# Altium schematic sheet PowerSupply.SchDoc
size A3
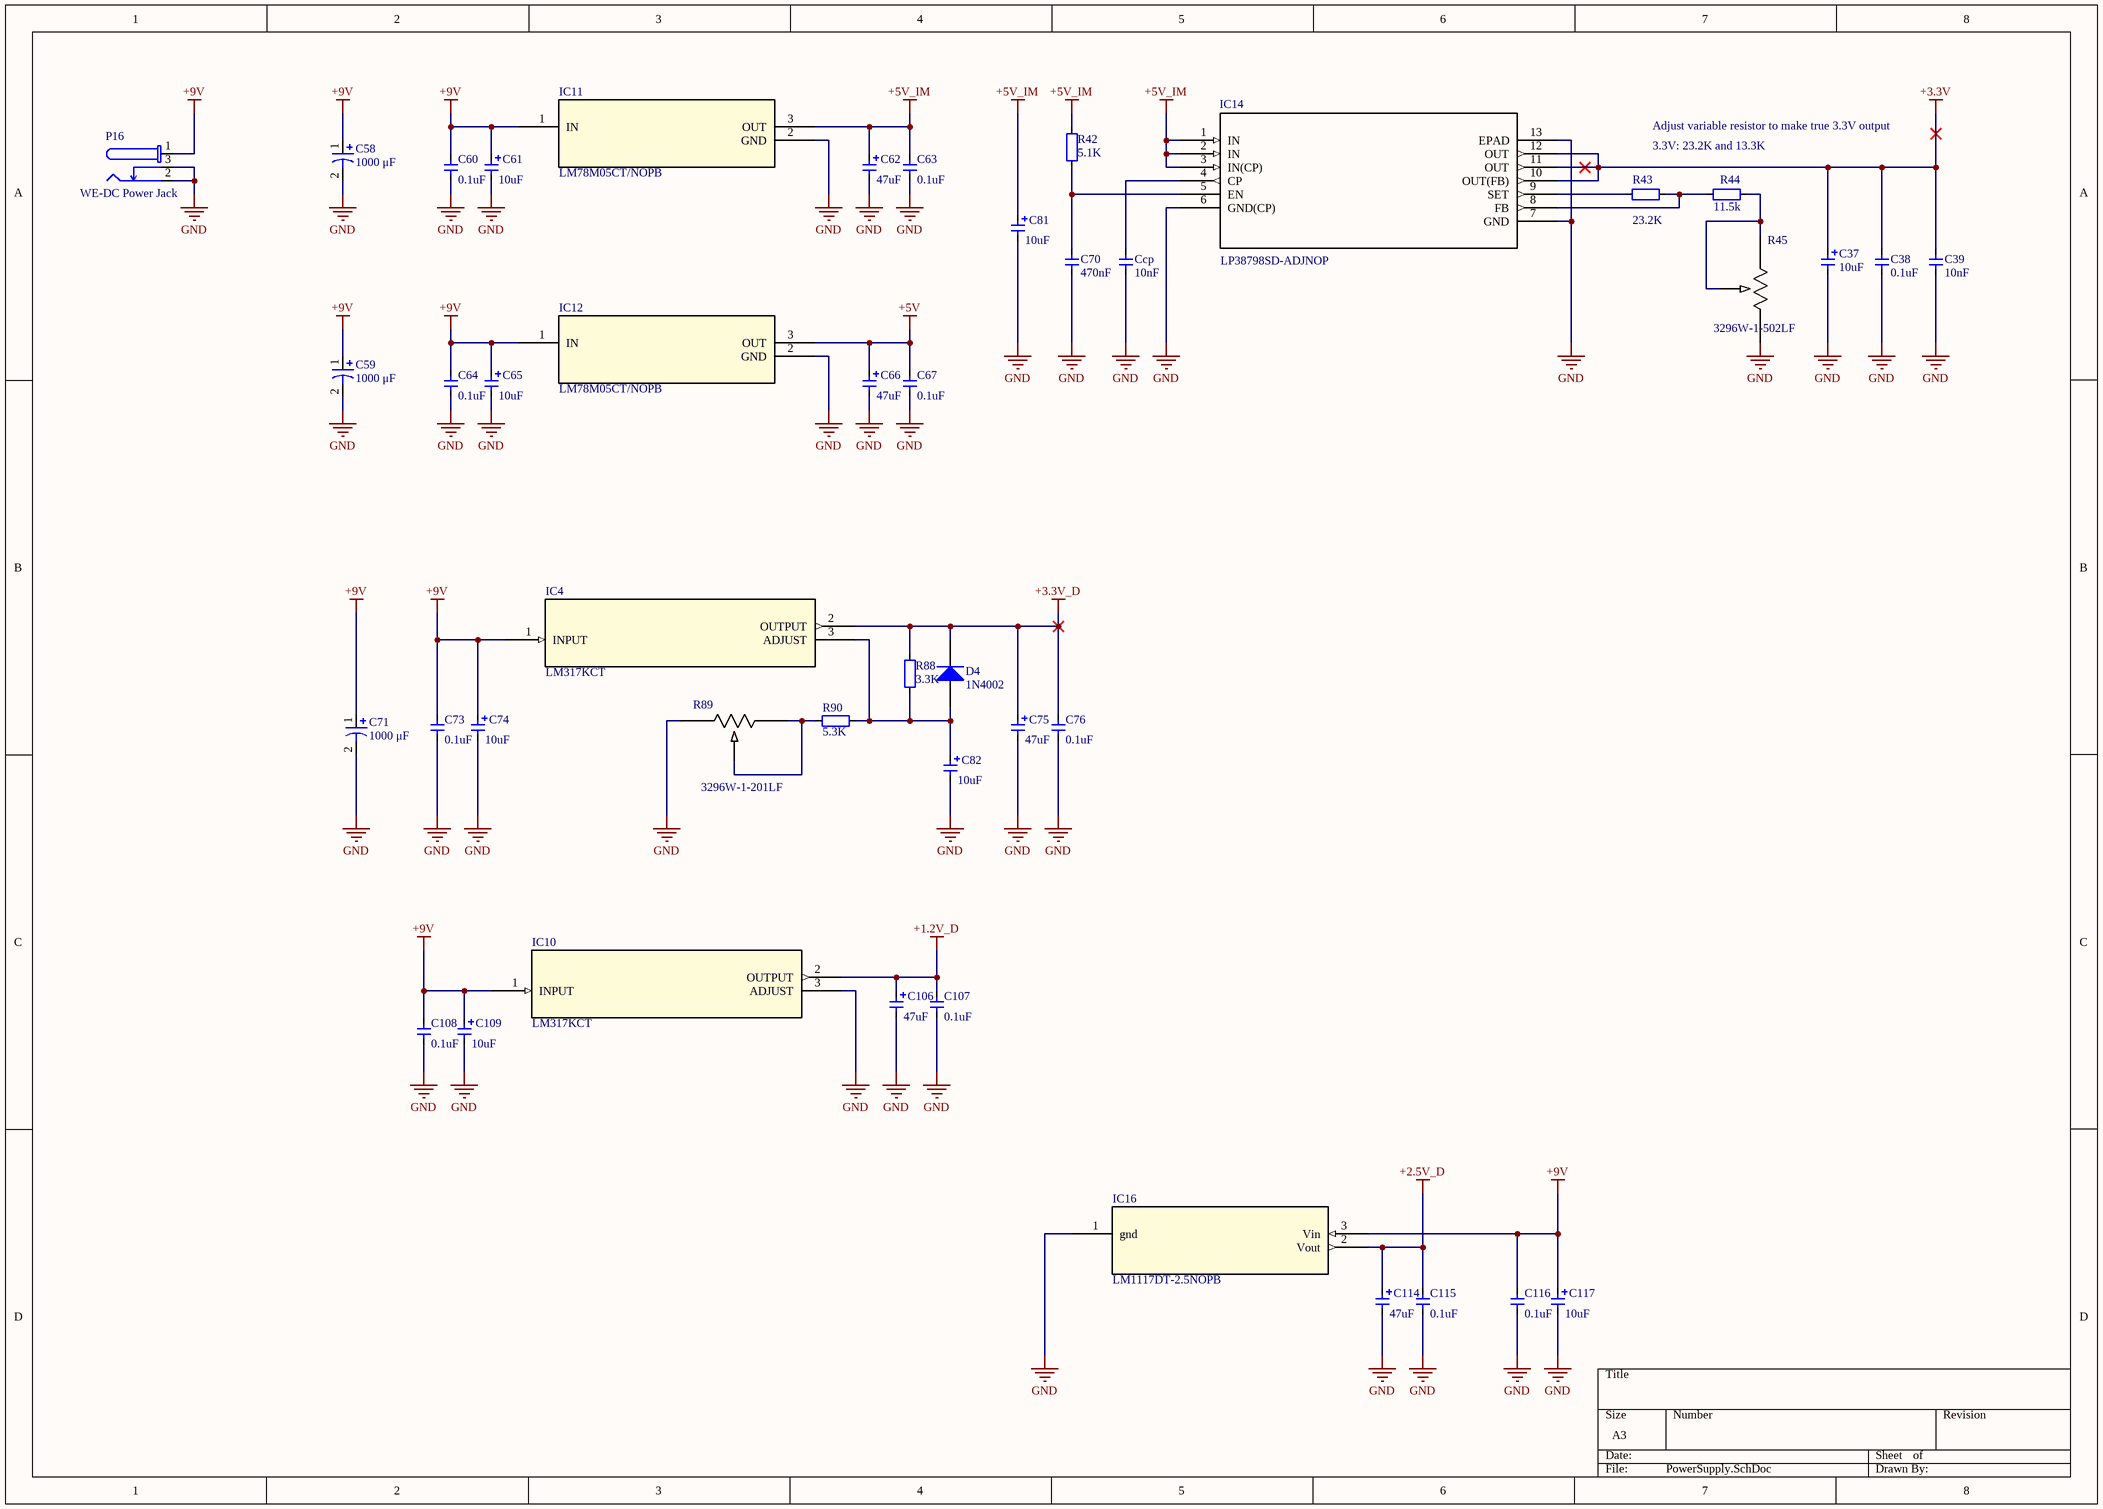
[diagram p0: PowerSupply.SchDoc]

## Parts
C37  value 10uF  [CAP_TAN_A1206]  (hidden comment: Cap_Tan_1206)
C38  value 0.1uF  [CAP_0603]  (hidden comment: Cap_0603)
C39  value 10nF  [CAP_0603]  (hidden comment: Cap_0603)
C58  1000 μF  [WCAP-ATUL 5x11x2x0.5]
C59  1000 μF  [WCAP-ATUL 5x11x2x0.5]
C60  value 0.1uF  [CAP_0603]  (hidden comment: Cap_0603)
C61  value 10uF  [CAP_TAN_A1206]  (hidden comment: Cap_Tan_1206)
C62  value 47uF  [CAP_TAN_A1206]  (hidden comment: Cap_Tan_1206)
C63  value 0.1uF  [CAP_0603]  (hidden comment: Cap_0603)
C64  value 0.1uF  [CAP_0603]  (hidden comment: Cap_0603)
C65  value 10uF  [CAP_TAN_A1206]  (hidden comment: Cap_Tan_1206)
C66  value 47uF  [CAP_TAN_A1206]  (hidden comment: Cap_Tan_1206)
C67  value 0.1uF  [CAP_0603]  (hidden comment: Cap_0603)
C70  value 470nF  [CAP_0603]  (hidden comment: Cap_0603)
C71  1000 μF  [WCAP-ATUL 5x11x2x0.5]
C73  value 0.1uF  [CAP_0603]  (hidden comment: Cap_0603)
C74  value 10uF  [CAP_TAN_A1206]  (hidden comment: Cap_Tan_1206)
C75  value 47uF  [CAP_TAN_A1206]  (hidden comment: Cap_Tan_1206)
C76  value 0.1uF  [CAP_0603]  (hidden comment: Cap_0603)
C81  value 10uF  [CAP_TAN_A1206]  (hidden comment: Cap_Tan_1206)
C82  value 10uF  [CAP_TAN_A1206]  (hidden comment: Cap_Tan_1206)
C106  value 47uF  [CAP_TAN_A1206]  (hidden comment: Cap_Tan_1206)
C107  value 0.1uF  [CAP_0603]  (hidden comment: Cap_0603)
C108  value 0.1uF  [CAP_0603]  (hidden comment: Cap_0603)
C109  value 10uF  [CAP_TAN_A1206]  (hidden comment: Cap_Tan_1206)
C114  value 47uF  [CAP_TAN_A1206]  (hidden comment: Cap_Tan_1206)
C115  value 0.1uF  [CAP_0603]  (hidden comment: Cap_0603)
C116  value 0.1uF  [CAP_0603]  (hidden comment: Cap_0603)
C117  value 10uF  [CAP_TAN_A1206]  (hidden comment: Cap_Tan_1206)
Ccp  value 10nF  [CAP_0603]  (hidden comment: Cap_0603)
D4  1N4002  [DO-41]
IC4  LM317KCT  [KC3]
IC10  LM317KCT  [KC3]
IC11  LM78M05CT/NOPB  [T03B]
IC12  LM78M05CT/NOPB  [T03B]
IC14  LP38798SD-ADJNOP  [DNT12]
IC16  LM1117DT-2.5NOPB  [TD03B]
P16  WE-DC Power Jack  [694106106102]
R42  value 5.1K  [RES_0603]  (hidden comment: Res_0603)
R43  value 23.2K  [RES_0603]  (hidden comment: Res_0603)
R44  value 11.5k  [RES_0603]  (hidden comment: Res_0603)
R45  3296W-1-502LF  [POT_3296W]
R88  value 3.3K  [RES_0603]  (hidden comment: Res_0603)
R89  3296W-1-201LF  [POT_3296W]
R90  value 5.3K  [RES_0603]  (hidden comment: Res_0603)

## Nets
+1.2V_D: C106.1 C107.2 IC10.2(OUTPUT)
+2.5V_D: C114.1 C115.2 IC16.2(Vout)
+3.3V: C37.1 C38.2 C39.2 IC14.10(OUT(FB)) IC14.11(OUT) IC14.12(OUT)
+3.3V_D: C75.1 C76.2 D4.2(K) IC4.2(OUTPUT) R88.2
+5V: C66.1 C67.2 IC12.3(OUT)
+5V_IM: C62.1 C63.2 C81.1 IC11.3(OUT) IC14.1(IN) IC14.2(IN) IC14.3(IN(CP)) R42.1
+9V: C58.1 C59.1 C60.2 C61.1 C64.2 C65.1 C71.1 C73.2 C74.1 C108.2 C109.1 C116.2 C117.1 IC4.1(INPUT) IC10.1(INPUT) IC11.1(IN) IC12.1(IN) IC16.3(Vin) P16.1
GND: C37.2 C38.1 C39.1 C58.2 C59.2 C60.1 C61.2 C62.2 C63.1 C64.1 C65.2 C66.2 C67.1 C70.1 C71.2 C73.1 C74.2 C75.2 C76.1 C81.2 C82.2 C106.2 C107.1 C108.1 C109.2 C114.2 C115.1 C116.1 C117.2 Ccp.1 IC10.3(ADJUST) IC11.2(GND) IC12.2(GND) IC14.6(GND(CP)) IC14.7(GND) IC14.13(EPAD) IC16.1(gnd) P16.2 P16.3 R45.1 R89.3
NetC70_2: C70.2 IC14.5(EN) R42.2
NetC82_1: C82.1 D4.1(A) IC4.3(ADJUST) R88.1 R90.2
NetCcp_2: Ccp.2 IC14.4(CP)
NetIC14_8: IC14.8(FB) R43.2 R44.2
NetIC14_9: IC14.9(SET) R43.1
NetR44_1: R44.1 R45.2 R45.3
NetR89_1: R89.1 R89.2 R90.1

## Notes on the sheet
- Adjust variable resistor to make true 3.3V output
- 3.3V: 23.2K and 13.3K

## Library data of the parts
C37 C61 C62 C65 C66 C74 C75 C81 C82 C106 C109 C114 C117 = Cap_Tan_1206: Capacitor
C38 C39 C60 C63 C64 C67 C70 C73 C76 C107 C108 C115 C116 Ccp = Cap_0603: Capacitor
C58 C59 C71 = WCAP-ATUL 5x11x2x0.5 860040272001: WCAP-ATUL Aluminum Electrolytic Capacitors , 100 μF; + / - 20%; 10 V , 5 x 11; Manufacturer: Wurth Elektronik; E-mail: libraries@we-online.com; Characteristics: Aluminum Electrolytic Capacitor;Recommended soldering: Wave;Operating temperature: –40 °C to +105 °C;Minimized ESR and long life product series;Load life: 4000–10000 h @ +105 °C; ComponentLink1Description: Manufacturer; ComponentLink1URL: http://www.we-online.com; ComponentLink2Description: Datasheet; ComponentLink2URL: http://katalog.we-online.de/pbs/datasheet/860040272001.pdf; Created by: Karrer Zheng; Created Date: 5/13/2015; Capacitance: 1000 μF; Application: Applied to high frequency secondary side output filter loop, general switching power supply, DC-DC converter, AC-DC converter, adapter, charger, TV, VCR, DC motor circuit filter, LCD TV digital audio, digital TV, digital camera, digital video camera, satellite receiver and etc.; partNo: 860040272001
D4 = Diode 1N4002: 1 Amp General Purpose Rectifier; Published: 8-Jun-2000; LatestRevisionDate: 17-Jul-2002; LatestRevisionNote: Re-released for DXP Platform.; DatasheetVersion: 1998; PackageVersion: Aug-1999; PackageReference: DO-41; Publisher: Altium Limited; PackageDescription: Diode, Axial; Body 5.2 x 2.7 mm (LxDia. max), Lead Dia. 0.86 mm (max); Code_JEDEC: DO-204-AL; ComponentLink1Description: Manufacturer Link; ComponentLink1URL: http://www.fairchildsemi.com/; ComponentLink2Description: Datasheet; ComponentLink2URL: http://www.fairchildsemi.com/ds/1N%2F1N4001.pdf
IC4 IC10 = LM317KCT: Imported; Manufacturer: Texas Instruments; GENERIC_PART_NUMBER: LM317; INDUSTRY_STD_PKG_TYPE: TO-220; FAMILY_NAME: STANDARD VOLTAGE REGULATOR; PIN_COUNT: 3; PACKAGE_DESIGNATOR: KC; 3D_Library_Name: TI_AllParts_2012-12-25; C: Copyright (C) 2015 Accelerated Designs. All rights reserved; Datasheet URL: http://www.ti.com/lit/gpn/LM317; Vendor: Texas Instruments; Manufacturer_Part_Number: LM317KCT; Copyright: Copyright (C) 2015 Accelerated Designs. All rights reserved; RefDes: RefDes; Type: DEV; Value: Value
IC11 IC12 = LM78M05CT/NOPB: Imported; Vendor: National Semiconductor; C: Copyright (C) 2015 Accelerated Designs. All rights reserved; Manufacturer_Part_Number: lm78m05ct; Copyright: Copyright (C) 2015 Accelerated Designs. All rights reserved; RefDes: RefDes; Type: DEV; Value: Value
IC14 = LP38798SD-ADJNOP: Imported; Manufacturer_Part_Number: lp38798sd-adj/nopb; Vendor: TEXAS INSTRUMENTS; C: Copyright (C) 2015 Accelerated Designs. All rights reserved; Copyright: Copyright (C) 2015 Accelerated Designs. All rights reserved; RefDes: RefDes; Type: DEV; Value: Value
IC16 = LM1117DT-1_8NOPB: Imported; Manufacturer_Part_Number: LM1117DT-18; Vendor: National Semiconductor; C: Copyright (C) 2015 Accelerated Designs. All rights reserved; Copyright: Copyright (C) 2015 Accelerated Designs. All rights reserved; RefDes: RefDes; Type: DEV; Value: Value
P16 = WE-DC Power Jack 694106106102: WR-DC_DC Power Jack_Right Angled_SMT; Manufacturer: WЁ№rth Elektronik eiSos GmbH; ComponentLink1 Description: Manufacturer; ComponentLink2 Description: Datasheet; NoPins: 4; ComponentLink1URL: http://www.we-online.de; ComponentLink2URL: http://katalog.we-online.de/em/datasheet/6941xx106102.pdf; Created by: Karrer Zheng; Created Date: 10/17/2014; partNo: 694106106102
R42-R44 R88 R90 = Res_0603: Resistor
R45 R89 = 3296W-1-503LF: Imported; Vendor: Bourns Electronics; HEADER_SECTION: Passives; HEADER_GROUP: Resistors; R-S_Number: 5219805; Tolerance: 10%; Voltage: Unknown; C: Copyright (C) 2015 Accelerated Designs. All rights reserved; Manufacturer_Part_Number: 3296W-1-503LF; Manufacturer_Name: Bourns Electronics; Mounting: Through Hole; Value: Value; Package/Case: Unknown; Current Rating: Unknown; Copyright: Copyright (C) 2015 Accelerated Designs. All rights reserved; RefDes: RefDes; Type: DEV